# EAGLE design GSM_M95 (EAGLE 7.1.0)
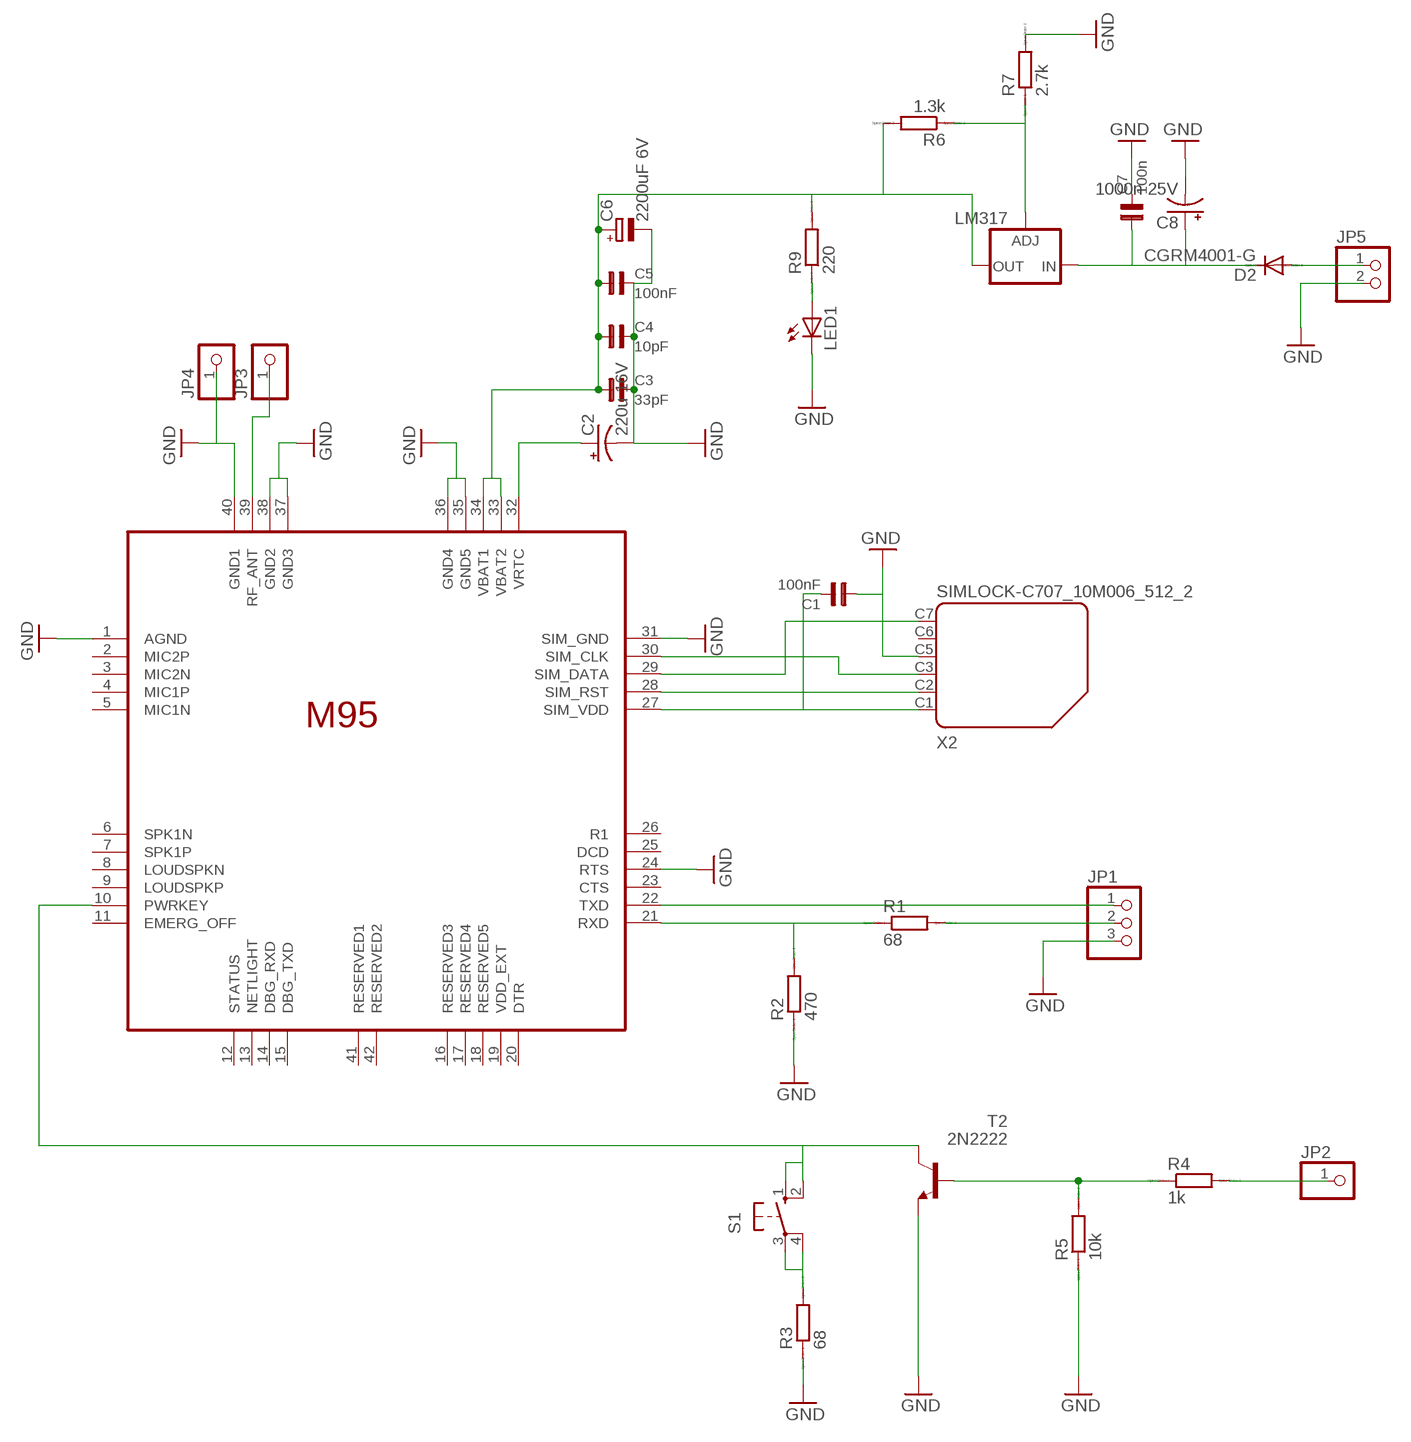
[diagram p0: schematic, sheet 1]

## Parts
C1  100nF  C1206  [1206]
C2  220u 16V  CPOL-USUD-6,3X7,7  [UD-6,3X7,7_NICHICON]
C3  33pF  C1206  [1206]
C4  10pF  C1206  [1206]
C5  100nF  C1206  [1206]
C6  2200uF 6V  CPOL-EUE5-10.5  [E5-10,5]
C7  100n  C1206  [1206]
C8  1000n 25V  CPOL-USE5-13  [E5-13]
D2  CGRM4001-G  [SOD-123_MINI-SMA]
JP1  PINHD-1X3  [1X03]
JP2  PINHD-1X1  [1X01]
JP3  PINHD-1X1  [1X01]
JP4  PINHD-1X1  [1X01]
JP5  PINHD-1X2  [1X02]
LED1  LED3MM  [LED3MM]
LM317  LM317TL  [317TL]
M95  M95_HD_V1.0  [M95]
R1  68  R-EU_R1206W  [R1206W]
R2  470  R-EU_R1206W  [R1206W]
R3  68  R-EU_R1206W  [R1206W]
R4  1k  R-EU_R1206W  [R1206W]
R5  10k  R-EU_R1206W  [R1206W]
R6  1.3k  R-EU_R1206W  [R1206W]
R7  2.7k  R-EU_R1206W  [R1206W]
R9  220  R-EU_R0805  [R0805]
S1  10-XX  [B3F-10XX]
T2  2N2222  2N2222-NPN-TO92-EBC  [TO92-EBC]
X2  SIMLOCK-C707_10M006_512_2  [C707_10M006_512_2]

## Nets
GND: C1.1 C2.- C3.2 C4.2 C5.2 C6.- C7.2 C8.- JP1.3 JP4.1 JP5.2 LED1.K(C) M95.1(AGND) M95.24(RTS) M95.31(SIM_GND) M95.35(GND5) M95.36(GND4) M95.37(GND3) M95.38(GND2) M95.40(GND1) R2.1 R3.1 R5.1 R7.2 T2.E X2.C5
N$2: M95.21(RXD) R1.1 R2.2
N$3: JP1.2 R1.2
N$4: LM317.1(ADJ) R6.1 R7.1
N$5: M95.10(PWRKEY) S1.1(S) S1.2(S1) T2.C
N$6: JP1.1 M95.22(TXD)
N$7: R3.2 S1.3(P) S1.4(P1)
N$8: C2.+ M95.32(VRTC)
N$9: C3.1 C4.1 C5.1 C6.+ LM317.2(OUT) M95.33(VBAT2) M95.34(VBAT1) R6.2 R9.2
N$10: R4.1 R5.2 T2.B
N$11: C1.2 M95.27(SIM_VDD) X2.C1
N$13: JP3.1 M95.39(RF_ANT)
N$14: C7.1 C8.+ D2.C LM317.3(IN)
N$15: JP2.1 R4.2
N$16: M95.28(SIM_RST) X2.C2
N$17: M95.29(SIM_DATA) X2.C7
N$18: M95.30(SIM_CLK) X2.C3
N$19: LED1.A R9.1
N$25: D2.A JP5.1
Unconnected: M95.2(MIC2P) M95.3(MIC2N) M95.4(MIC1P) M95.5(MIC1N) M95.6(SPK1N) M95.7(SPK1P) M95.8(LOUDSPKN) M95.9(LOUDSPKP) M95.11(EMERG_OFF) M95.12(STATUS) M95.13(NETLIGHT) M95.14(DBG_RXD) M95.15(DBG_TXD) M95.16(RESERVED3) M95.17(RESERVED4) M95.18(RESERVED5) M95.19(VDD_EXT) M95.20(DTR) M95.23(CTS) M95.25(DCD) M95.26(R1) M95.41(RESERVED1) M95.42(RESERVED2) X2.C6

## Library data of the parts
C1 C3-C5 C7 = capsmd:C1206
C2 C8 = rcl:CPOL-US: POLARIZED CAPACITOR, American symbol
C6 = rcl:CPOL-EU: POLARIZED CAPACITOR, European symbol
D2 = diode:CGRM400*-G: Molded plasitc,JEDEC SOD-123/Mini SMA Source: Comchip CGRM4001-G.pdf
JP1 = pinhead:PINHD-1X3: PIN HEADER
JP2-JP4 = pinhead:PINHD-1X1: PIN HEADER
JP5 = pinhead:PINHD-1X2: PIN HEADER
LED1 = led:LED: LED OSRAM: - CHIPLED LG R971, LG N971, LY N971, LG Q971, LY Q971, LO R971, LY R971 LH N974, LH R974 LS Q976, LO Q976, LY Q976 LO Q996 - Hyper CHIPLED LW Q18S LB Q993, LB Q99A, LB R99A - SideLED LS A670, LO A670, LY A670, LG A670, LP A670 LB A673, LV A673, LT A673, LW A673 LH A674 LY A675 LS A676, LA A676, LO A676, LY A676, LW A676 LS A679, LY A679, LG A679 - Hyper Micro SIDELED® LS Y876, LA Y876, LO Y876, LY Y876 LT Y87S - SmartLED LW L88C, LW L88S LB L89C, LB L89S, LG L890 LS L89K, LO L89K, LY L89K LS L896, LA L896, LO L896, LY L896 - TOPLED LS T670, LO T670, LY T670, LG T670, LP T670 LSG T670, LSP T670, LSY T670, LOP T670, LYG T670 LG T671, LOG T671, LSG T671 LB T673, LV T673, LT T673, LW T673 LH T674 LS T676, LA T676, LO T676, LY T676, LB T676, LH T676, LSB T676, LW T676 LB T67C, LV T67C, LT T67C, LS T67K, LO T67K, LY T67K, LW E67C LS E67B, LA E67B, LO E67B, LY E67B, LB E67C, LV E67C, LT E67C LW T67C LS T679, LY T679, LG T679 LS T770, LO T770, LY T770, LG T770, LP T770 LB T773, LV T773, LT T773, LW T773 LH T774 LS E675, LA E675, LY E675, LS T675 LS T776, LA T776, LO T776, LY T776, LB T776 LHGB T686 LT T68C, LB T68C - Hyper Mini TOPLED® LB M676 - Mini TOPLED Santana® LG M470 LS M47K, LO M47K, LY M47K Source: http://www.osram.convergy.de LUXEON: - LUMILED® LXK2-PW12-R00, LXK2-PW12-S00, LXK2-PW14-U00, LXK2-PW14-V00 LXK2-PM12-R00, LXK2-PM12-S00, LXK2-PM14-U00 LXK2-PE12-Q00, LXK2-PE12-R00, LXK2-PE12-S00, LXK2-PE14-T00, LXK2-PE14-U00 LXK2-PB12-K00, LXK2-PB12-L00, LXK2-PB12-M00, LXK2-PB14-N00, LXK2-PB14-P00, LXK2-PB14-Q00 LXK2-PR12-L00, LXK2-PR12-M00, LXK2-PR14-Q00, LXK2-PR14-R00 LXK2-PD12-Q00, LXK2-PD12-R00, LXK2-PD12-S00 LXK2-PH12-R00, LXK2-PH12-S00 LXK2-PL12-P00, LXK2-PL12-Q00, LXK2-PL12-R00 Source: www.luxeon.com KINGBRIGHT: KA-3528ASYC Source: www.kingbright.com
LM317 = v-reg:LM317TL: VOLTAGE REGULATOR
M95 = m95_quectel:M95_HD_V1.0
R1-R7 R9 = resistor:R-EU_: RESISTOR, European symbol; SPICEPREFIX: R
S1 = switch-omron:10-XX: OMRON SWITCH; MPN: B3F-1000; OC_FARNELL: 176432; OC_NEWARK: 36M3542
T2 = transistor-neu-to92:*-NPN-: NPN Transistror
X2 = con-amphenol:SIMLOCK-C707_10M006_512_2: C707A SIMLOCK® 2.5 mm with wide solder tails Source: Data sheet <http://www.amphenol.info/downloads/C707_10M006_512_2.pdf>; OC_FARNELL: unknown; OC_NEWARK: unknown

## Board
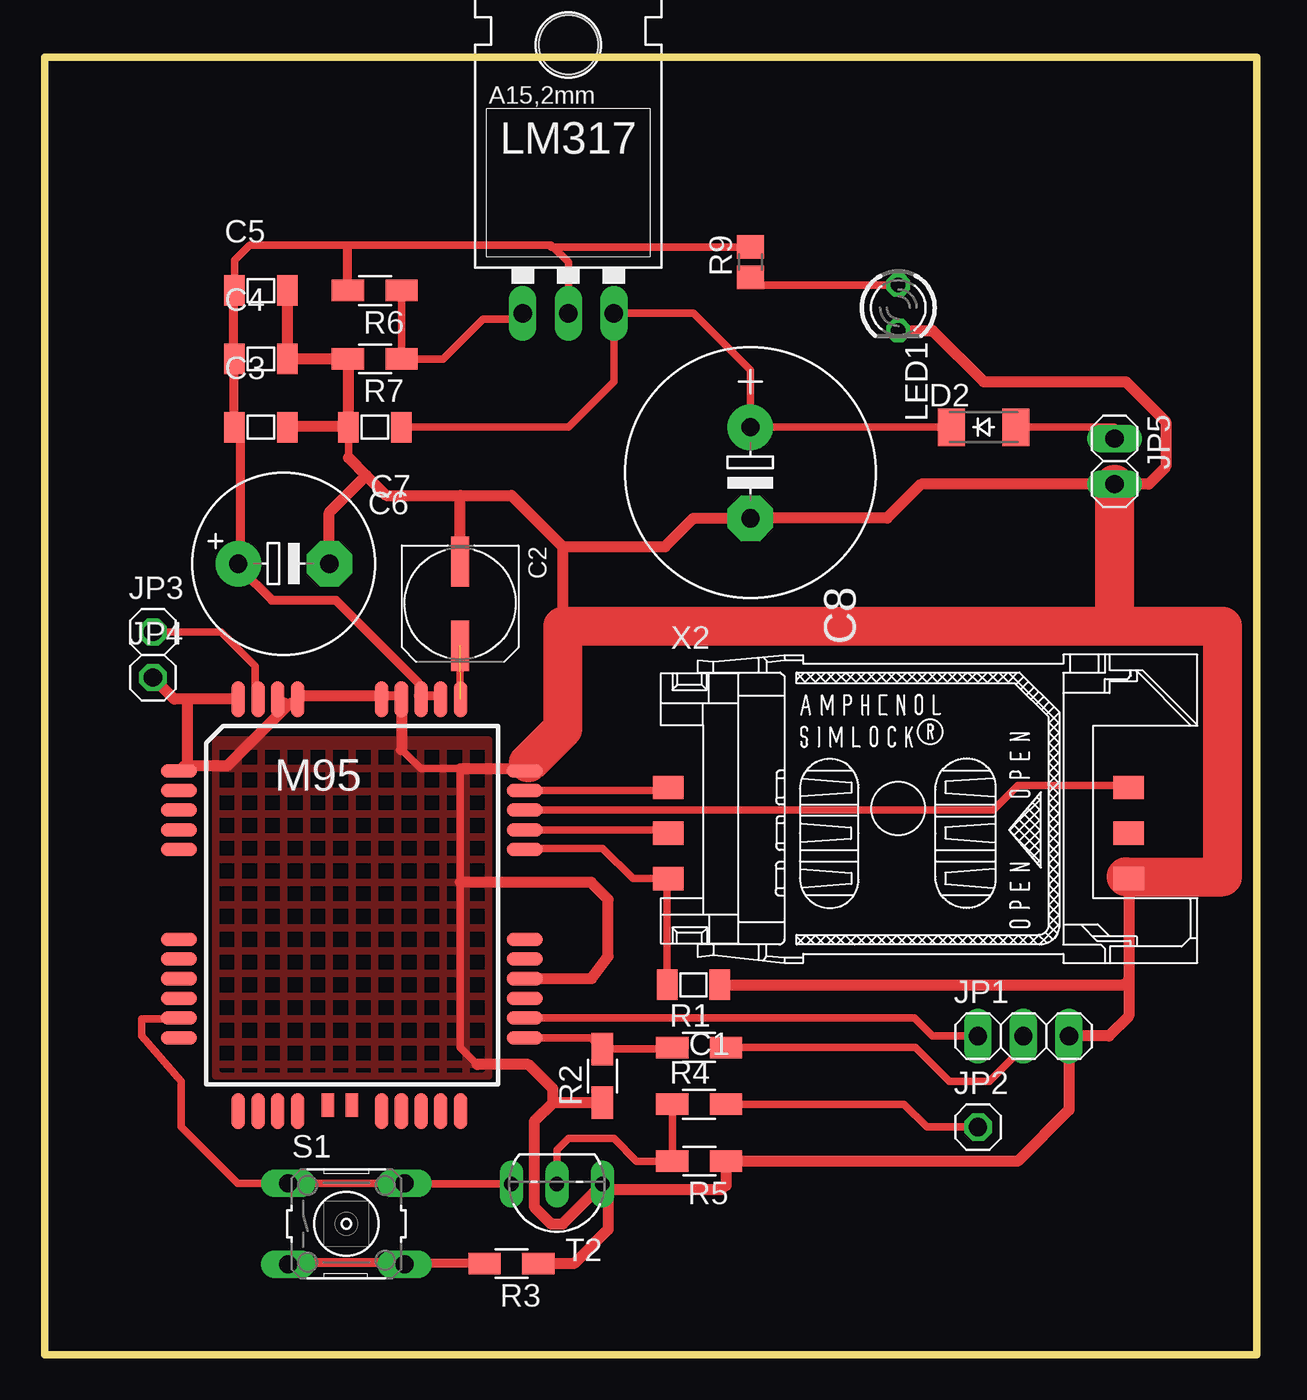
[diagram p1: board, top side]

Size 67.63 x 72.39 mm. Coordinates in mm from the lower left corner, seen from the top.
Outline: 0,0 67.63,0 67.63,72.39 0,72.39 0,0
Copper layers (1*16): Top 0.035mm / dielectric 1.5mm / Bottom 0.035mm
Design rules "default *": minimum track width 20mil, minimum drill 40mil, track to track 8mil, track to pad 8mil, pad to pad 8mil, via to via 8mil, smd to smd 8mil, copper to edge 40mil, drill to drill 8mil, minimum pad ring 10mil, minimum via ring 8mil, stop-mask expansion 4mil, vias tented up to drill 0mil, thermal gap 10mil

### Footprints (pad centres in the part's own frame; a part is rotated, then mirrored left to right if it is on the bottom)
1206 = smd 1.143 x 1.702: 1 -1.473,0; 2 1.473,0
UD-6,3X7,7_NICHICON = smd 2.8 x 1: + 2.35,0; - -2.35,0
E5-10,5 = drill 1.016 pad 2.54: + -2.54,0 | drill 1.016 pad 2.54 octagon: - 2.54,0
E5-13 = drill 1.016 pad 2.54: + -2.54,0 | drill 1.016 pad 2.54 octagon: - 2.54,0
SOD-123_MINI-SMA = smd 1.5 x 2.1: A 1.8,0; C -1.8,0
1X03 = drill 1.016 long: 1 -2.54,0; 2 0,0; 3 2.54,0
1X01 = drill 1.016 octagon: 1 0,0
1X02 = drill 1.016 long: 1 -1.27,0; 2 1.27,0
LED3MM = drill 0.813 octagon: A -1.27,0; K 1.27,0
317TL = drill 1.016 long: 1 -2.54,-3.81; 2 0,-3.81; 3 2.54,-3.81 | hole 3.302: 0,11.176
M95 = smd 2 x 0.75: 1 -9.65,7.5; 2 -9.65,6.4; 3 -9.65,5.3; 4 -9.65,4.2; 5 -9.65,3.1; 6 -9.65,-1.9; 7 -9.65,-3; 8 -9.65,-4.1; 9 -9.65,-5.2; 10 -9.65,-6.3; 11 -9.65,-7.4; 21 9.65,-7.4; 22 9.65,-6.3; 23 9.65,-5.2; 24 9.65,-4.1; 25 9.65,-3; 26 9.65,-1.9; 27 9.65,3.1; 28 9.65,4.2; 29 9.65,5.3; 30 9.65,6.4; 31 9.65,7.5 | smd 0.75 x 2: 12 -6.35,-11.5; 13 -5.25,-11.5; 14 -4.15,-11.5; 15 -3.05,-11.5; 16 1.65,-11.5; 17 2.75,-11.5; 18 3.85,-11.5; 19 4.95,-11.5; 20 6.05,-11.5; 32 6.05,11.5; 33 4.95,11.5; 34 3.85,11.5; 35 2.75,11.5; 36 1.65,11.5; 37 -3.05,11.5; 38 -4.15,11.5; 39 -5.25,11.5; 40 -6.35,11.5 | smd 0.7 x 1.32: 41 -1.35,-11.16 | smd 0.7 x 1.3: 42 0,-11.15
R1206W = smd 1.8 x 1.2: 1 -1.499,0; 2 1.499,0
R0805 = smd 1.3 x 1.5: 1 -0.85,0; 2 0.85,0
B3F-10XX = drill 1.016 long: 1 -3.251,2.261; 2 3.251,2.261; 3 -3.251,-2.261; 4 3.251,-2.261
TO92-EBC = drill 0.813 long: B 0,-1.27; C 2.54,-1.27; E -2.54,-1.27
C707_10M006_512_2 = smd 1.7 x 1.3: C1 -12.85,-3.915; C2 -12.85,-1.375; C3 -12.85,1.165; C5 12.85,-3.915; C6 12.85,-1.375; C7 12.85,1.165

### Placement (x,y rotation side)
C1  36.2,20.64 180 top
C2  23.18,41.91 270 top
C3  12.07,51.75 0 top
C4  12.07,55.56 0 top
C5  12.07,59.37 0 top
C6  13.34,44.13 0 top
C7  18.42,51.75 180 top
C8  39.37,49.21 270 top
D2  52.39,51.75 0 top
JP1  54.61,17.78 0 top
JP2  52.07,12.7 0 top
JP3  6.03,40.32 0 top
JP4  6.03,37.78 0 top
JP5  59.69,49.85 270 top
LED1  47.62,58.42 270 top
LM317  29.21,61.91 0 top
M95  17.14,25.08 0 top
R1  36.51,17.15 0 top
R2  31.11,15.56 90 top
R3  26.04,5.08 180 top
R4  36.51,13.97 0 top
R5  36.51,10.79 180 top
R6  18.42,59.37 180 top
R7  18.42,55.56 180 top
R9  39.37,60.96 90 top
S1  16.83,7.3 0 top
T2  28.57,8.26 180 top
X2  47.62,30.48 0 top

### Tracks (layer width: path | path; a pad name or v marks a point on that pad's centre or on a via)
GND
  Top 0.406: 16.92,51.78 C7.2 16.94,50.05 | 38.01,9.44 37.78,9.21 | 31.43,9.21 T2.E | 19.89,33.76 20.96,32.7 23.18,32.7 23.18,26.35 23.18,17.15 24.13,16.19 | 26.68,32.7 M95.31 | 60.16,20.64 60.47,20.95 | 13.56,51.78 C3.2
  Top 0.508: 7.94,32.85 7.7,32.85 M95.1 | M95.38 13.03,36.41 13.39,36.41 13.56,36.23 13.74,36.41 M95.37 14.1,36.77 | M95.35 19.79,36.77 19.07,36.77 M95.36 18.72,36.77
  Top 0.61: 13.56,36.23 10.19,32.85 7.94,32.85 7.94,36.58 M95.40 7.23,36.58 JP4.1 | 18.72,36.77 14.1,36.77 | 16.94,50.05 17.94,49.05 | 17.94,49.05 19.05,47.94 23.18,47.94 | 23.18,47.94 26.04,47.94 28.89,45.08 | 28.89,45.08 28.89,35.24 28.89,34.68 M95.31 | 28.89,45.08 34.61,45.08 36.2,46.67 C8.- 46.99,46.67 48.89,48.58 JP5.2 61.59,48.58 62.55,49.53 62.55,52.07 60.33,54.29 52.39,54.29 49.53,57.15 LED1.K | X2.C5 60.47,20.95 60.47,18.88 59.37,17.78 JP1.3 57.15,13.65 54.29,10.79 R5.1 38.01,9.44 | 37.78,9.21 31.43,9.21 31.43,6.99 29.53,5.08 R3.1 | M95.35 19.89,33.76 | 23.18,32.7 26.68,32.7 | C1.1 60.16,20.64 | R2.1 28.35,14.06 | 28.35,14.06 27.31,13.02 27.31,8.26 28.26,7.3 28.89,7.3 T2.E | M95.24 30.51,20.98 31.43,22.22 31.43,25.4 30.48,26.35 23.18,26.35 | 28.35,14.06 28.35,14.83 26.99,16.19 24.13,16.19 | C2.- 23.18,47.94 | C6.- 15.88,46.99 17.94,49.05 | 13.56,51.78 16.92,51.78 R7.2 C4.2 C5.2
  Top 2.184: 60.33,26.67 65.72,26.67 65.72,40.64 59.69,40.64 | 59.69,40.64 28.89,40.64 28.89,35.24 28.89,34.93 26.99,33.02 | JP5.2 59.69,40.64
  pour Top (isolate 0.406, hatched): 9.53,34.29 24.77,34.29 24.77,15.56 9.53,15.56
N$2
  Top 0.406: M95.21 30.49,17.68 R2.2 34.92,17.06 R1.1
N$3
  Top 0.406: R1.2 48.58,17.15 50.48,15.24 52.7,15.24 54.61,17.15 JP1.2
N$4
  Top 0.406: LM317.1 26.35,57.78 24.45,57.78 22.22,55.56 R7.1 R6.1
N$5
  Top 0.406: T2.C 20.12,9.53 S1.2 S1.1 10.76,9.56 7.62,12.7 7.62,15.24 5.4,17.78 5.4,18.73 7.45,18.73 M95.10
N$6
  Top 0.406: M95.22 48.53,18.78 49.53,17.78 JP1.1
N$7
  Top 0.508: R3.2 24.41,5.12 20.14,5.12 S1.4 19.79,5.12 13.74,5.12 S1.3
N$8  (1 unrouted)
N$9
  Top 0.406: C5.1 10.59,61.07 11.43,61.91 16.83,61.91 | 16.83,61.91 16.83,59.46 R6.2 16.92,61.82 16.83,61.91 | 16.83,61.91 28.26,61.91 | 28.26,61.91 29.21,60.96 LM317.2 | R9.2 28.26,61.81 28.26,61.91
  Top 0.508: M95.33 21.92,36.77 21.21,36.77 M95.34 20.85,36.77 20.85,37.48 16.23,42.1 12.68,42.1 10.9,43.88 C6.+ 10.9,44.23 10.9,51.7 C3.1 10.54,52.06 10.54,55.26 C4.1 10.54,55.61 10.54,59.17 C5.1
N$10
  Top 0.406: R4.1 R5.2 33.02,10.79 31.75,12.06 29.21,12.06 28.57,11.43 T2.B
N$11
  Top 0.406: C1.2 34.72,26.51 X2.C1 32.81,26.57 31.11,28.26 26.87,28.26 M95.27
N$13
  Top 0.406: JP3.1 9.84,40.32 11.75,38.42 11.75,36.73 M95.39
N$14
  Top 0.406: C7.1 29.21,51.75 31.75,54.29 LM317.3 36.2,58.1 39.37,54.93 C8.+ D2.C
N$15
  Top 0.406: R4.2 47.94,13.97 49.21,12.7 JP2.1
N$16
  Top 0.406: M95.28 34.28,29.28 X2.C2
N$17
  Top 0.406: M95.29 52.92,30.38 54.29,31.75 60.37,31.75 X2.C7
N$18
  Top 0.406: M95.30 34.62,31.48 X2.C3
N$19
  Top 0.406: LED1.A 39.37,59.69 R9.1
N$20
  Top 0.406: 23.18,36.51 23.18,39.69
N$25
  Top 0.406: D2.A 59.69,51.75 JP5.1